# EasyEDA Pro project 4090_Portable_Fan.epro, schematic 备份
Create Date: 2025-08-08; Page Name: P1; Project Name: 基于STC8G的风扇控制主板; Schematic Name: 备份; Update Date: 2025-08-09; Company: 嘉立创EDA; Page Size: A4; Version: V1.0
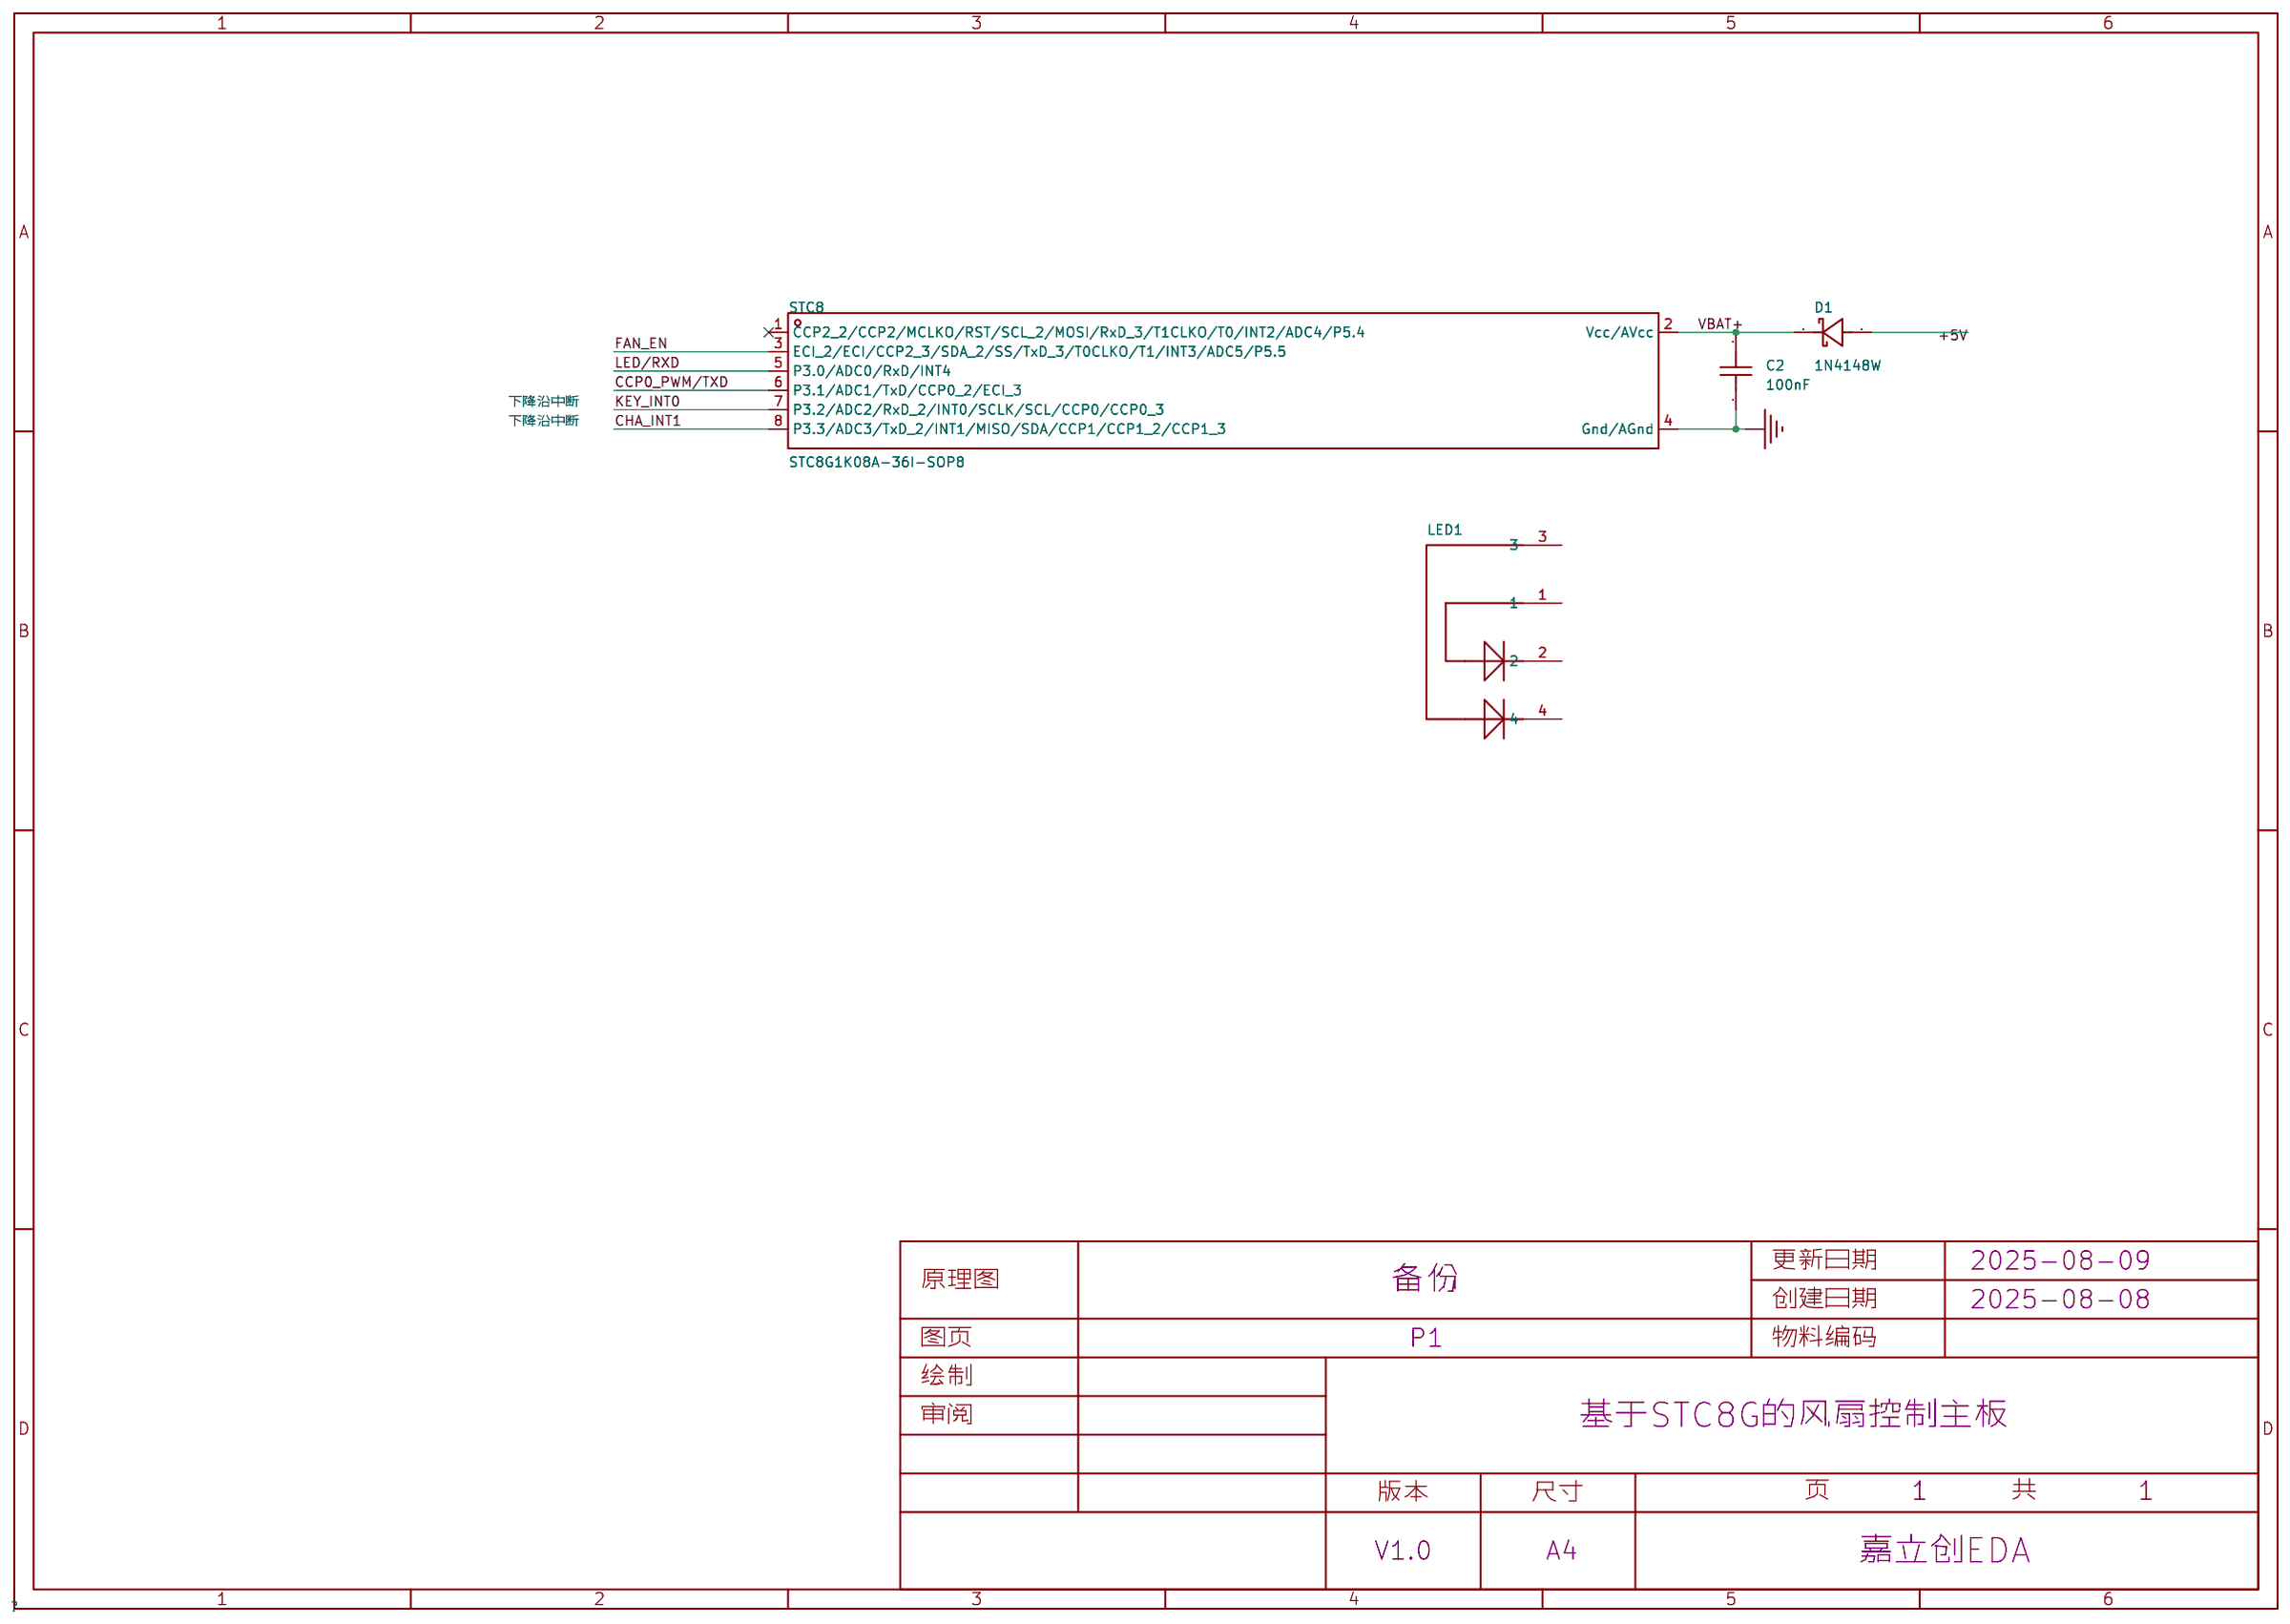
[diagram p5: schematic sheet]

## Parts
C2  100nF  [C0805]
D1  1N4148W  [SOD-123_L2.7-W1.6-LS3.7-FD]
LED1  -  [1206 侧贴双色LED]
STC8  STC8G1K08A-36I-SOP8  [SOP-8_L5.0-W4.0-P1.27-LS6.0-BL]

## Library data of the parts
C2 = CAP_0603: Supplier Footprint: 0603
D1 = 1N4148W_C7420318: 二极管配置:独立式;正向压降(Vf):1.25V@150mA;直流反向耐压(Vr):100V;整流电流:150mA;反向恢复时间(trr):4ns;; Supplier Part: C7420318; Manufacturer: 宏迦橙; Supplier Footprint: SOD-123; JLCPCB Part Class: 扩展库; Datasheet: https://atta.szlcsc.com/upload/public/pdf/source/20230828/E5C3F7A4272052930A7E03B75759BF50.pdf; Supplier: LCSC; Diode Configuration: 独立式; Forward Voltage (Vf@If): 1.25V@150mA; Reverse Voltage (Vr): 100V; Rectified Current: 150mA; Reverse Leakage Current (Ir): 1uA@75V; Reverse Recovery Time (trr): 4ns; Operating Temperature: -55℃~+150℃
LED1 = 1206侧发光红绿LED
STC8 = STC8G1K08A-36I-SOP8: CPU内核:51系列;应用领域:-;; Supplier Part: C915663; Manufacturer: STC; Supplier Footprint: SOP-8; JLCPCB Part Class: 扩展库; Datasheet: https://atta.szlcsc.com/upload/public/pdf/source/20241226/1556D7EB67C0BC8C1661C3E278549CA4.pdf; Supplier: LCSC; CPU Core: 51系列; Program Storage Size: 8KB; Program Memory Type: FLASH; Number of I/O: 6; ADC (Bit): 10bit; Low Voltage Detection Threshold: 1.9V~5.5V

## Nets
+5V: D1.1(A)
GND: C2.1 STC8.4(Gnd/AGnd)
VBAT+: C2.2 D1.2(K) STC8.2(Vcc/AVcc)
CCP0_PWM/TXD: STC8.6(P3.1/ADC1/TxD/CCP0_2/ECI_3)
CHA_INT1: STC8.8(P3.3/ADC3/TxD_2/INT1/MISO/SDA/CCP1/CCP1_2/CCP1_3)
FAN_EN: STC8.3(ECI_2/ECI/CCP2_3/SDA_2/SS/TxD_3/T0CLKO/T1/INT3/ADC5/P5.5)
KEY_INT0: STC8.7(P3.2/ADC2/RxD_2/INT0/SCLK/SCL/CCP0/CCP0_3)
LED/RXD: STC8.5(P3.0/ADC0/RxD/INT4)

Not connected (* = marked no-connect by the designer): LED1 1 2 3 4; STC8 1(CCP2_2/CCP2/MCLKO/RST/SCL_2/MOSI/RxD_3/T1CLKO/T0/INT2/ADC4/P5.4)*

## Notes on the sheet
- 下降沿中断
- 下降沿中断
